# Altium schematic sheet STM.SchDoc
size A; SheetNumber: 1; SheetTotal: 4
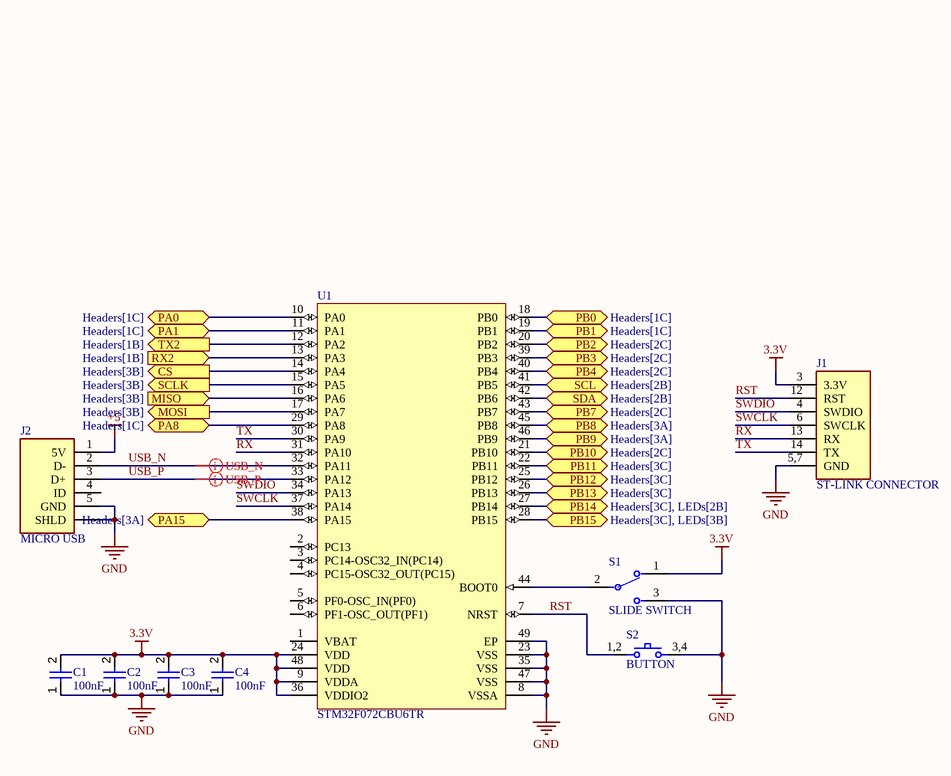
[diagram p0: STM.SchDoc]

## Parts
C1  value 100nF  [CAP_0603]  (hidden comment: CAP .1uF)
C2  value 100nF  [CAP_0603]  (hidden comment: CAP .1uF)
C3  value 100nF  [CAP_0603]  (hidden comment: CAP .1uF)
C4  value 100nF  [CAP_0603]  (hidden comment: CAP .1uF)
J1  ST-LINK CONNECTOR  [FTSH10701LDVKTR]
J2  MICRO USB  [101181940001LF]
S1  SLIDE SWITCH  [SLW8839352AD]
S2  BUTTON  [TS026643BK100SCRD]
U1  STM32F072CBU6TR  [STM-UFQFPN48_L]

## Ports
CS (out, see Headers[3B]), MISO (in, see Headers[3B]), MOSI (out, see Headers[3B]), PA0 (bidir, see Headers[1C]), PA1 (bidir, see Headers[1C]), PA8 (bidir, see Headers[1C]), PA15 (bidir, see Headers[3A]), PB0 (bidir, see Headers[1C]), PB1 (bidir, see Headers[1C]), PB2 (bidir, see Headers[2C]), PB3 (bidir, see Headers[2C]), PB4 (bidir, see Headers[2C]), PB7 (bidir, see Headers[2C]), PB8 (bidir, see Headers[3A]), PB9 (bidir, see Headers[3A]), PB10 (bidir, see Headers[2C]), PB11 (bidir, see Headers[3C]), PB12 (bidir, see Headers[3C]), PB13 (bidir, see Headers[3C]), PB14 (bidir, see Headers[3C], LEDs[2B]), PB15 (bidir, see Headers[3C], LEDs[3B]), RX2 (in, see Headers[1B]), SCL (bidir, see Headers[2B]), SCLK (out, see Headers[3B]), SDA (bidir, see Headers[2B]), TX2 (out, see Headers[1B])

## Nets
3.3V: C1.2 C2.2 C3.2 C4.2 J1.3(3.3V) S1.1 U1.9(VDDA) U1.24(VDD) U1.36(VDDIO2) U1.48(VDD)
+5: J2.1(5V)
GND: C1.1 C2.1 C3.1 C4.1 J1.5,7(GND) J2.5(GND) J2.SHLD S1.3 S2.3,4 U1.8(VSSA) U1.23(VSS) U1.35(VSS) U1.47(VSS) U1.49(EP)
CS: U1.14(PA4) ; port CS
MISO: U1.16(PA6) ; port MISO
MOSI: U1.17(PA7) ; port MOSI
PA0: U1.10(PA0) ; port PA0
PA1: U1.11(PA1) ; port PA1
PA8: U1.29(PA8) ; port PA8
PA15: U1.38(PA15) ; port PA15
PB0: U1.18(PB0) ; port PB0
PB1: U1.19(PB1) ; port PB1
PB2: U1.20(PB2) ; port PB2
PB3: U1.39(PB3) ; port PB3
PB4: U1.40(PB4) ; port PB4
PB7: U1.43(PB7) ; port PB7
PB8: U1.45(PB8) ; port PB8
PB9: U1.46(PB9) ; port PB9
PB10: U1.21(PB10) ; port PB10
PB11: U1.22(PB11) ; port PB11
PB12: U1.25(PB12) ; port PB12
PB13: U1.26(PB13) ; port PB13
PB14: U1.27(PB14) ; port PB14
PB15: U1.28(PB15) ; port PB15
RST: J1.12(RST) S2.1,2 U1.7(NRST)
RX: J1.13(RX) U1.31(PA10)
RX2: U1.13(PA3) ; port RX2
SCL: U1.41(PB5) ; port SCL
SCLK: U1.15(PA5) ; port SCLK
SDA: U1.42(PB6) ; port SDA
SWCLK: J1.6(SWCLK) U1.37(PA14)
SWDIO: J1.4(SWDIO) U1.34(PA13)
TX: J1.14(TX) U1.30(PA9)
TX2: U1.12(PA2) ; port TX2
USB_N: J2.2(D-) U1.32(PA11)
USB_P: J2.3(D+) U1.33(PA12)
NetS1_2: S1.2(C) U1.44(BOOT0)

Not connected (* = marked no-connect by the designer): J2 4(ID); U1 1(VBAT) 2(PC13) 3(PC14-OSC32_IN(PC14)) 4(PC15-OSC32_OUT(PC15)) 5(PF0-OSC_IN(PF0)) 6(PF1-OSC_OUT(PF1))

## Layout directives
differential pair: USB_N, USB_P

## Library data of the parts
C1-C4 = CMP-001-00086-1: Capacitor .1uF 10% 16V 0603; Voltage Rating: 16V; Source: Generic_Schematic_Library.SchLib; Design Item ID: CAP .1uF; Tolerance: 10%
J1 = CMP-002-00025-2: Connector; Manufacturer_Name: SAMTEC; Manufacturer_Part_Number: FTSH-107-01-L-DV-K-TR; Pins: 7; Design Item ID: ST-LINK CONNECTOR; Component Type: Standard; Source: SamacSys.SchLib; Mouser Part Number: 200-FTSH10701LDVKTR; Arrow Part Number: FTSH-107-01-L-DV-K-TR; Mouser Price/Stock: https://www.mouser.co.uk/ProductDetail/Samtec/FTSH-107-01-L-DV-K-TR?qs=%252BZP6%2F%252BtExtDlh0wyxE013Q%3D%3D; Height: 6.25mm; Arrow Price/Stock: https://www.arrow.com/en/products/ftsh-107-01-l-dv-k-tr/samtec?utm_currency=USD&region=nac; Datasheet Link: https://suddendocs.samtec.com/prints/ftsh-1xx-xx-xxx-dv-xxx-xxx-x-xx-mkt.pdf?_gl=1*mdiyn1*_ga*MTcyMTUxMTIwMy4xNzEyMDQxMTc2*_ga_3KFNZC07WW*MTcxMjEzMDIxOS4yLjEuMTcxMjEzMDI1NC4yNS4wLjA.
J2 = CMP-00030-1: Connector; pin to pad: SHLD>MH1+MH2+MH3+MH4+MP1+MP2; Manufacturer_Name: Amphenol Communications Solutions; Height: 3.25mm; Manufacturer_Part_Number: 10118194-0001LF; Source: SamacSys.SchLib; Design Item ID: 10118194-0001LF; Datasheet Link: https://www.amphenol-cs.com/micro-usb-101181940001lf.html; Arrow Price/Stock: https://www.arrow.com/en/products/10118194-0001lf/amphenol-fci?utm_currency=USD&region=nac; Arrow Part Number: 10118194-0001LF
S1 = CMP-00033-2: Switch; Manufacturer_Name: Same Sky; Design Item ID: SLW-883935-2A-D; Datasheet Link: https://www.sameskydevices.com/product/resource/supplyframepdf/slw-883935-2a-d.pdf; Arrow Part Number: SLW-883935-2A-D; Manufacturer_Part_Number: SLW-883935-2A-D; Height: 6.1mm; Mouser Price/Stock: https://www.mouser.co.uk/ProductDetail/Same-Sky/SLW-883935-2A-D?qs=1Kr7Jg1SGW%2Fv9j8ky6fn%2FQ%3D%3D; Mouser Part Number: 179-SLW-883935-2A-D; Arrow Price/Stock: https://www.arrow.com/en/products/slw-883935-2a-d/cui-devices?utm_currency=USD&region=nac; Source: SamacSys.SchLib
S2 = CMP-00032-1: pin to pad: 1,2>1+2 3,4>3+4; Manufacturer_Name: Same Sky; Mouser Part Number: 179-TS026643BK100SCR; Arrow Part Number: TS02-66-43-BK-100-SCR-D; Datasheet Link: https://www.sameskydevices.com/product/resource/ts02.pdf; Mouser Price/Stock: https://www.mouser.co.uk/ProductDetail/Same-Sky/TS02-66-43-BK-100-SCR-D?qs=A6eO%252BMLsxmSl2Xr0zcGVOg%3D%3D; Manufacturer_Part_Number: TS02-66-43-BK-100-SCR-D; Height: 4.5mm; Source: SamacSys.SchLib; Arrow Price/Stock: https://www.arrow.com/en/products/ts02-66-43-bk-100-scr-d/cui-devices?utm_currency=USD&region=nac; Design Item ID: TS02-66-43-BK-100-SCR-D
U1 = CMP-0304-00174-1: ARM Cortex-M0 32-bit MCU, 128 KB Flash, 16 KB Internal RAM, 37 I/Os, 48-Pin UFQFPN, -40 to 85 degC, Tape and Reel; I/Os (High Current): 37; Internal RAM Size (kB): 16; D/A Converter: 1; FLASH Size (Prog) (kB): 128; Supply Voltage(Vcc) min (V): 2; Operating Frequency(F) (Processor speed) (MHz): 48; DatasheetVersion: Rev. 5; ComponentLink1Description: Manufacturer URL; ComponentLink2URL: http://www.st.com/st-web-ui/static/active/en/resource/technical/document/datasheet/DM00090510.pdf; ComponentLink2Description: Datasheet; Core: ARM Cortex-M0; ComponentLink1URL: http://www.st.com/; Package Reference: UFQFPN48; Packing: Tape and Reel; Mounting Technology: Surface Mount; Package Description: 48-Pin Ultra Thin Fine Pitch Quad Flat No-Lead, 7 x 7 x 0.6 mm Body, 0.5 mm Pitch, Exposed Pad